# EAGLE design M7672X (EAGLE 6.6.0)
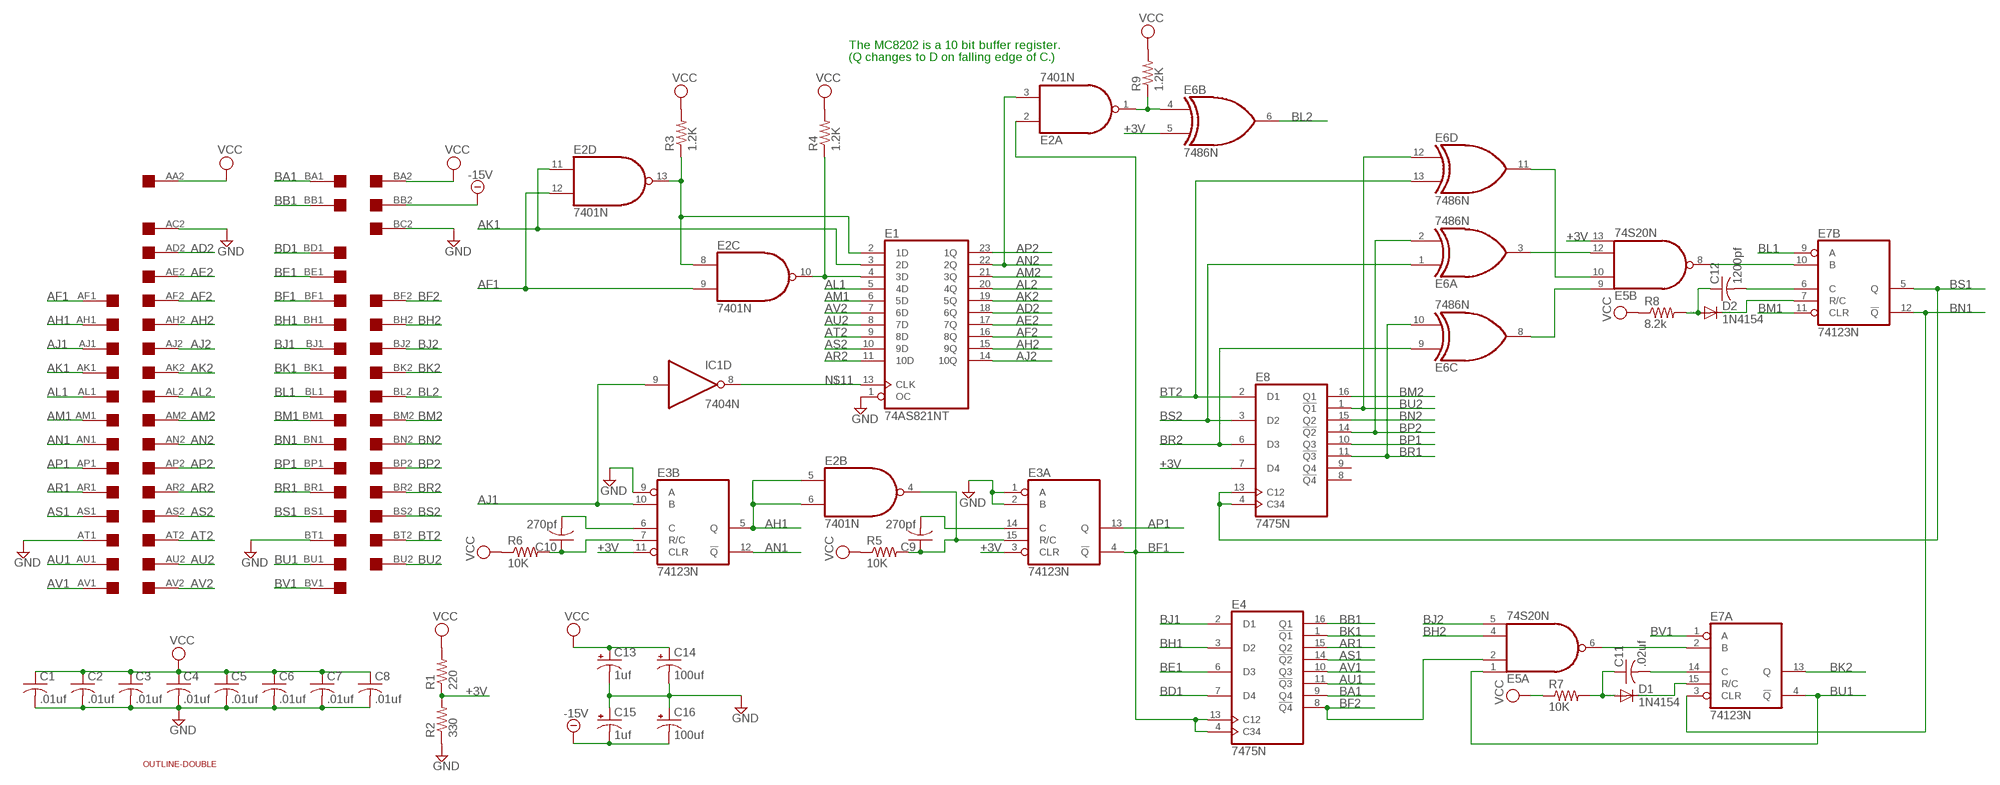
[diagram p0: schematic, sheet 1]

## Parts
C1  .01uf  C-US050-025X075  [C050-025X075]
C2  .01uf  C-US050-025X075  [C050-025X075]
C3  .01uf  C-US050-025X075  [C050-025X075]
C4  .01uf  C-US050-025X075  [C050-025X075]
C5  .01uf  C-US050-025X075  [C050-025X075]
C6  .01uf  C-US050-025X075  [C050-025X075]
C7  .01uf  C-US050-025X075  [C050-025X075]
C8  .01uf  C-US050-025X075  [C050-025X075]
C9  270pf  C-US050-025X075  [C050-025X075]
C10  270pf  C-US050-025X075  [C050-025X075]
C11  .02uf  C-US050-025X075  [C050-025X075]
C12  1200pf  C-US050-025X075  [C050-025X075]
C13  1uf  CPOL-USE30-10AXIAL  [E30-10]
C14  100uf  CPOL-USE30-10AXIAL  [E30-10]
C15  1uf  CPOL-USE30-10AXIAL  [E30-10]
C16  100uf  CPOL-USE30-10AXIAL  [E30-10]
D1  1N4154  1N4148DO35-10  [DO35-10]
D2  1N4154  1N4148DO35-10  [DO35-10]
E1  74AS821NT  [DIL24-6]
E2  7401N  74LS01N  [DIL14]
E3  74123N  [DIL16]
E4  7475N  [DIL16]
E5  74S20N  [DIL14]
E6  7486N  [DIL14]
E7  74123N  [DIL16]
E8  7475N  [DIL16]
EDGE  DOUBLE  [EDGE-CON4]
IC1  7404N  [DIL14]
R1  220  R-US_0207/10  [0207/10]
R2  330  R-US_0207/10  [0207/10]
R3  1.2K  R-US_0207/10  [0207/10]
R4  1.2K  R-US_0207/10  [0207/10]
R5  10K  R-US_0207/10  [0207/10]
R6  10K  R-US_0207/10  [0207/10]
R7  10K  R-US_0207/10  [0207/10]
R8  8.2k  R-US_0207/10  [0207/10]
R9  1.2K  R-US_0207/10  [0207/10]
U$2  OUTLINE-DOUBLE  [DOUBLE]

## Nets
+3V: E3.3(A:CLR) E3.11(B:CLR) E5.13(B:I3) E6.5(B:I1) E8.7(D4) R1.1 R2.2
-15V: C15.- C16.- EDGE.BB2
AD2: E1.18(6Q) EDGE.AD2
AE2: E1.17(7Q) EDGE.AE2
AF1: E2.9(C:I1) E2.12(D:I1) EDGE.AF1
AF2: E1.16(8Q) EDGE.AF2
AH1: E2.5(B:I0) E2.6(B:I1) E3.5(B:Q) EDGE.AH1
AH2: E1.15(9Q) EDGE.AH2
AJ1: E3.10(B:B) EDGE.AJ1 IC1.9(D:I)
AJ2: E1.14(10Q) EDGE.AJ2
AK1: E1.3(2D) E2.11(D:I0) EDGE.AK1
AK2: E1.19(5Q) EDGE.AK2
AL1: E1.5(4D) EDGE.AL1
AL2: E1.20(4Q) EDGE.AL2
AM1: E1.6(5D) EDGE.AM1
AM2: E1.21(3Q) EDGE.AM2
AN1: E3.12(B:!Q) EDGE.AN1
AN2: E1.22(2Q) E2.3(A:I1) EDGE.AN2
AP1: E3.13(A:Q) EDGE.AP1
AP2: E1.23(1Q) EDGE.AP2
AR1: E4.15(Q2) EDGE.AR1
AR2: E1.11(10D) EDGE.AR2
AS1: E4.14(!Q2) EDGE.AS1
AS2: E1.10(9D) EDGE.AS2
AT2: E1.9(8D) EDGE.AT2
AU1: E4.11(!Q3) EDGE.AU1
AU2: E1.8(7D) EDGE.AU2
AV1: E4.10(Q3) EDGE.AV1
AV2: E1.7(6D) EDGE.AV2
BA1: E4.9(Q4) EDGE.BA1
BB1: E4.16(Q1) EDGE.BB1
BD1: E4.7(D4) EDGE.BD1
BE1: E4.6(D3) EDGE.BE1
BF1: E2.2(A:I0) E3.4(A:!Q) E4.4(C34) E4.13(C12) EDGE.BF1
BF2: E4.8(!Q4) E5.2(A:I1) EDGE.BF2
BH1: E4.3(D2) EDGE.BH1
BH2: E5.4(A:I2) EDGE.BH2
BJ1: E4.2(D1) EDGE.BJ1
BJ2: E5.5(A:I3) EDGE.BJ2
BK1: E4.1(!Q1) EDGE.BK1
BK2: E7.13(A:Q) EDGE.BK2
BL1: E7.9(B:A) EDGE.BL1
BL2: E6.6(B:O) EDGE.BL2
BM1: E7.11(B:CLR) EDGE.BM1
BM2: E8.16(Q1) EDGE.BM2
BN1: E7.3(A:CLR) E7.12(B:!Q) EDGE.BN1
BN2: E8.15(Q2) EDGE.BN2
BP1: E8.10(Q3) EDGE.BP1
BP2: E6.2(A:I1) E8.14(!Q2) EDGE.BP2
BR1: E6.10(C:I1) E8.11(!Q3) EDGE.BR1
BR2: E6.9(C:I0) E8.6(D3) EDGE.BR2
BS1: E7.5(B:Q) E8.4(C34) E8.13(C12) EDGE.BS1
BS2: E6.1(A:I0) E8.3(D2) EDGE.BS2
BT2: E6.13(D:I1) E8.2(D1) EDGE.BT2
BU1: E5.1(A:I0) E7.4(A:!Q) EDGE.BU1
BU2: E6.12(D:I0) E8.1(!Q1) EDGE.BU2
BV1: E7.1(A:A) EDGE.BV1
GND [power]: C1.2 C2.2 C3.2 C4.2 C5.2 C6.2 C7.2 C8.2 C13.- C14.- C15.+ C16.+ E1.1(OC) E3.1(A:A) E3.2(A:B) E3.9(B:A) EDGE.AC2 EDGE.AT1 EDGE.BC2 EDGE.BT1 R2.1
N$1: E1.2(1D) E2.8(C:I0) E2.13(D:O) R3.1
N$2: E1.4(3D) E2.10(C:O) R4.1
N$3: E2.1(A:O) E6.4(B:I0) R9.1
N$4: E5.12(B:I2) E6.3(A:O)
N$5: C10.1 E3.7(B:R/C) R6.2
N$6: C10.2 E3.6(B:C)
N$7: C9.1 E2.4(B:O) E3.15(A:R/C) R5.2
N$8: C9.2 E3.14(A:C)
N$9: E5.10(B:I1) E6.11(D:O)
N$10: E5.9(B:I0) E6.8(C:O)
N$11: E1.13(CLK) IC1.8(D:O)
N$12: E5.6(A:O) E7.2(A:B)
N$13: D1.C E7.15(A:R/C)
N$14: C11.2 E7.14(A:C)
N$15: C11.1 D1.A R7.2
N$16: E5.8(B:O) E7.10(B:B)
N$17: D2.C E7.7(B:R/C)
N$18: C12.2 E7.6(B:C)
N$19: C12.1 D2.A R8.2
VCC [power]: C1.1 C2.1 C3.1 C4.1 C5.1 C6.1 C7.1 C8.1 C13.+ C14.+ EDGE.AA2 EDGE.BA2 R1.2 R3.2 R4.2 R5.1 R6.1 R7.1 R8.1 R9.2
Unconnected: E8.8(!Q4) E8.9(Q4) EDGE.AA1 EDGE.AB1 EDGE.AB2 EDGE.AC1 EDGE.AD1 EDGE.AE1 EDGE.BC1 EDGE.BD2 EDGE.BE2 EDGE.BV2 IC1.1(A:I) IC1.2(A:O) IC1.3(B:I) IC1.4(B:O) IC1.5(C:I) IC1.6(C:O) IC1.10(E:O) IC1.11(E:I) IC1.12(F:O) IC1.13(F:I)

## Notes on the sheet
- The MC8202 is a 10 bit buffer register.
- (Q changes to D on falling edge of C.)

## Power pins joined to a net without a drawn wire
GND: E1.12(GND) E2.7(P:GND) E3.8(P:GND) E4.12(GND) E5.7(P:GND) E6.7(P:GND) E7.8(P:GND) E8.12(GND) IC1.7(P:GND)
VCC: E1.24(VCC) E2.14(P:VCC) E3.16(P:VCC) E4.5(VCC) E5.14(P:VCC) E6.14(P:VCC) E7.16(P:VCC) E8.5(VCC) IC1.14(P:VCC)

## Library data of the parts
C1-C12 = rcl:C-US: CAPACITOR, American symbol
C13-C16 = rcl:CPOL-US: POLARIZED CAPACITOR, American symbol
D1 D2 = diode:1N4148: DIODE high speed (Philips)
E1 = 74xx-us:74*821: 10-bit bus interface FLIP FLOP
E2 = 74xx-us:74*01: Quad 2-input NAND gate, open collector
E3 E7 = 74xx-us:74*123: Retriggerable monostable MULTIVIBRATOR
E4 E8 = 74xx-us:74*75: 4-bit bistable LATCH
E5 = 74xx-us:74*20: Dual 4-input NAND gate
E6 = 74xx-us:74*86: Quad 2-input EXCLUSIV-OR (XOR) gate
EDGE = dec-con:DOUBLE: Double-Height DEC board
IC1 = 74xx-us:74*04: Hex INVERTER
R1-R9 = rcl:R-US_: RESISTOR, American symbol
U$2 = dec-con:OUTLINE-*: Board outlines for DEC boards.

## Net classes
1 power: width 0.508 mm

## Board
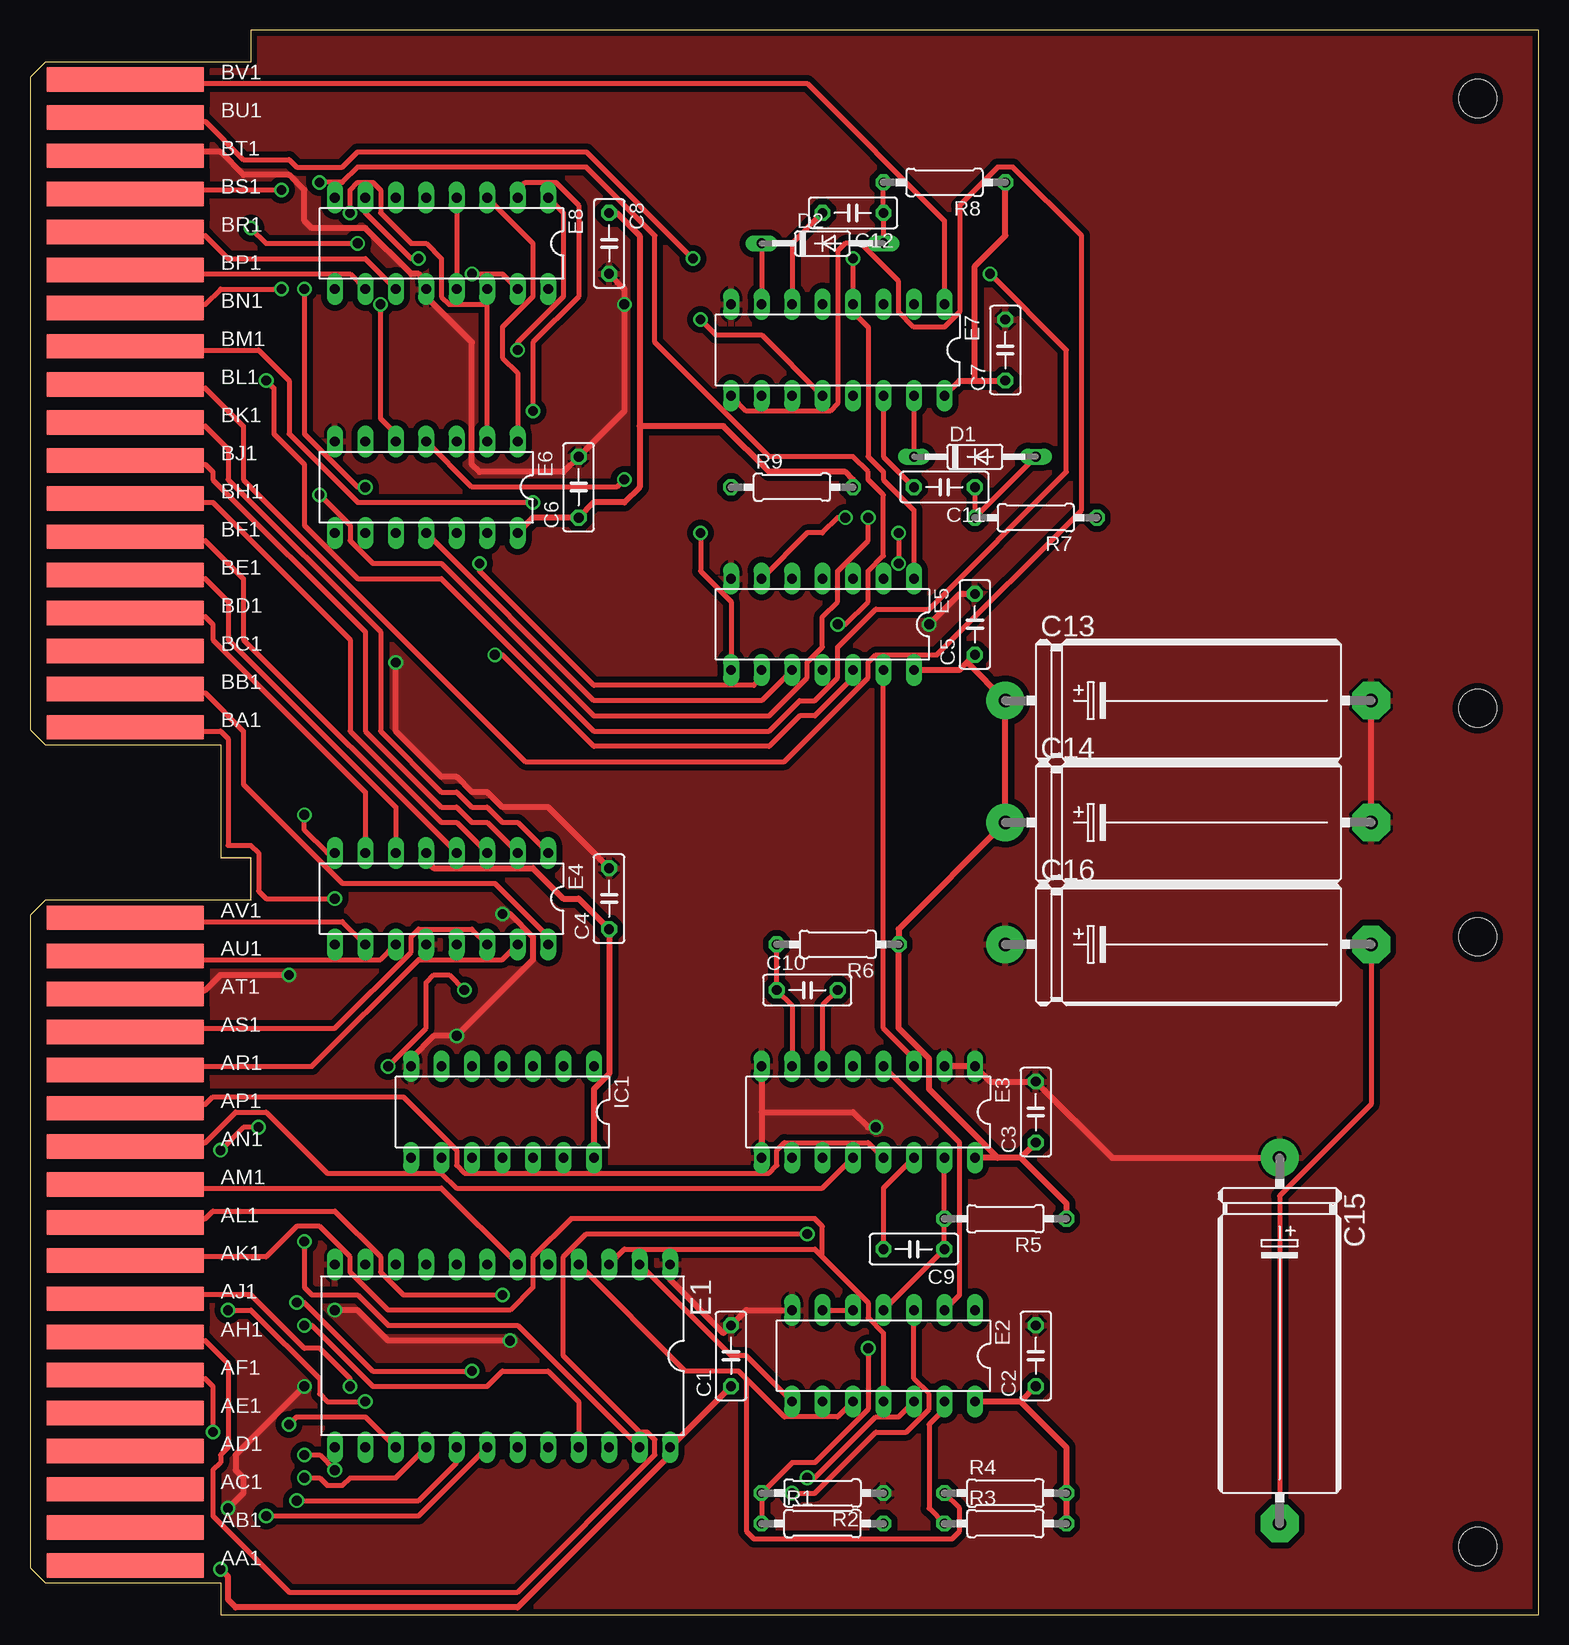
[diagram p1: board, top side]
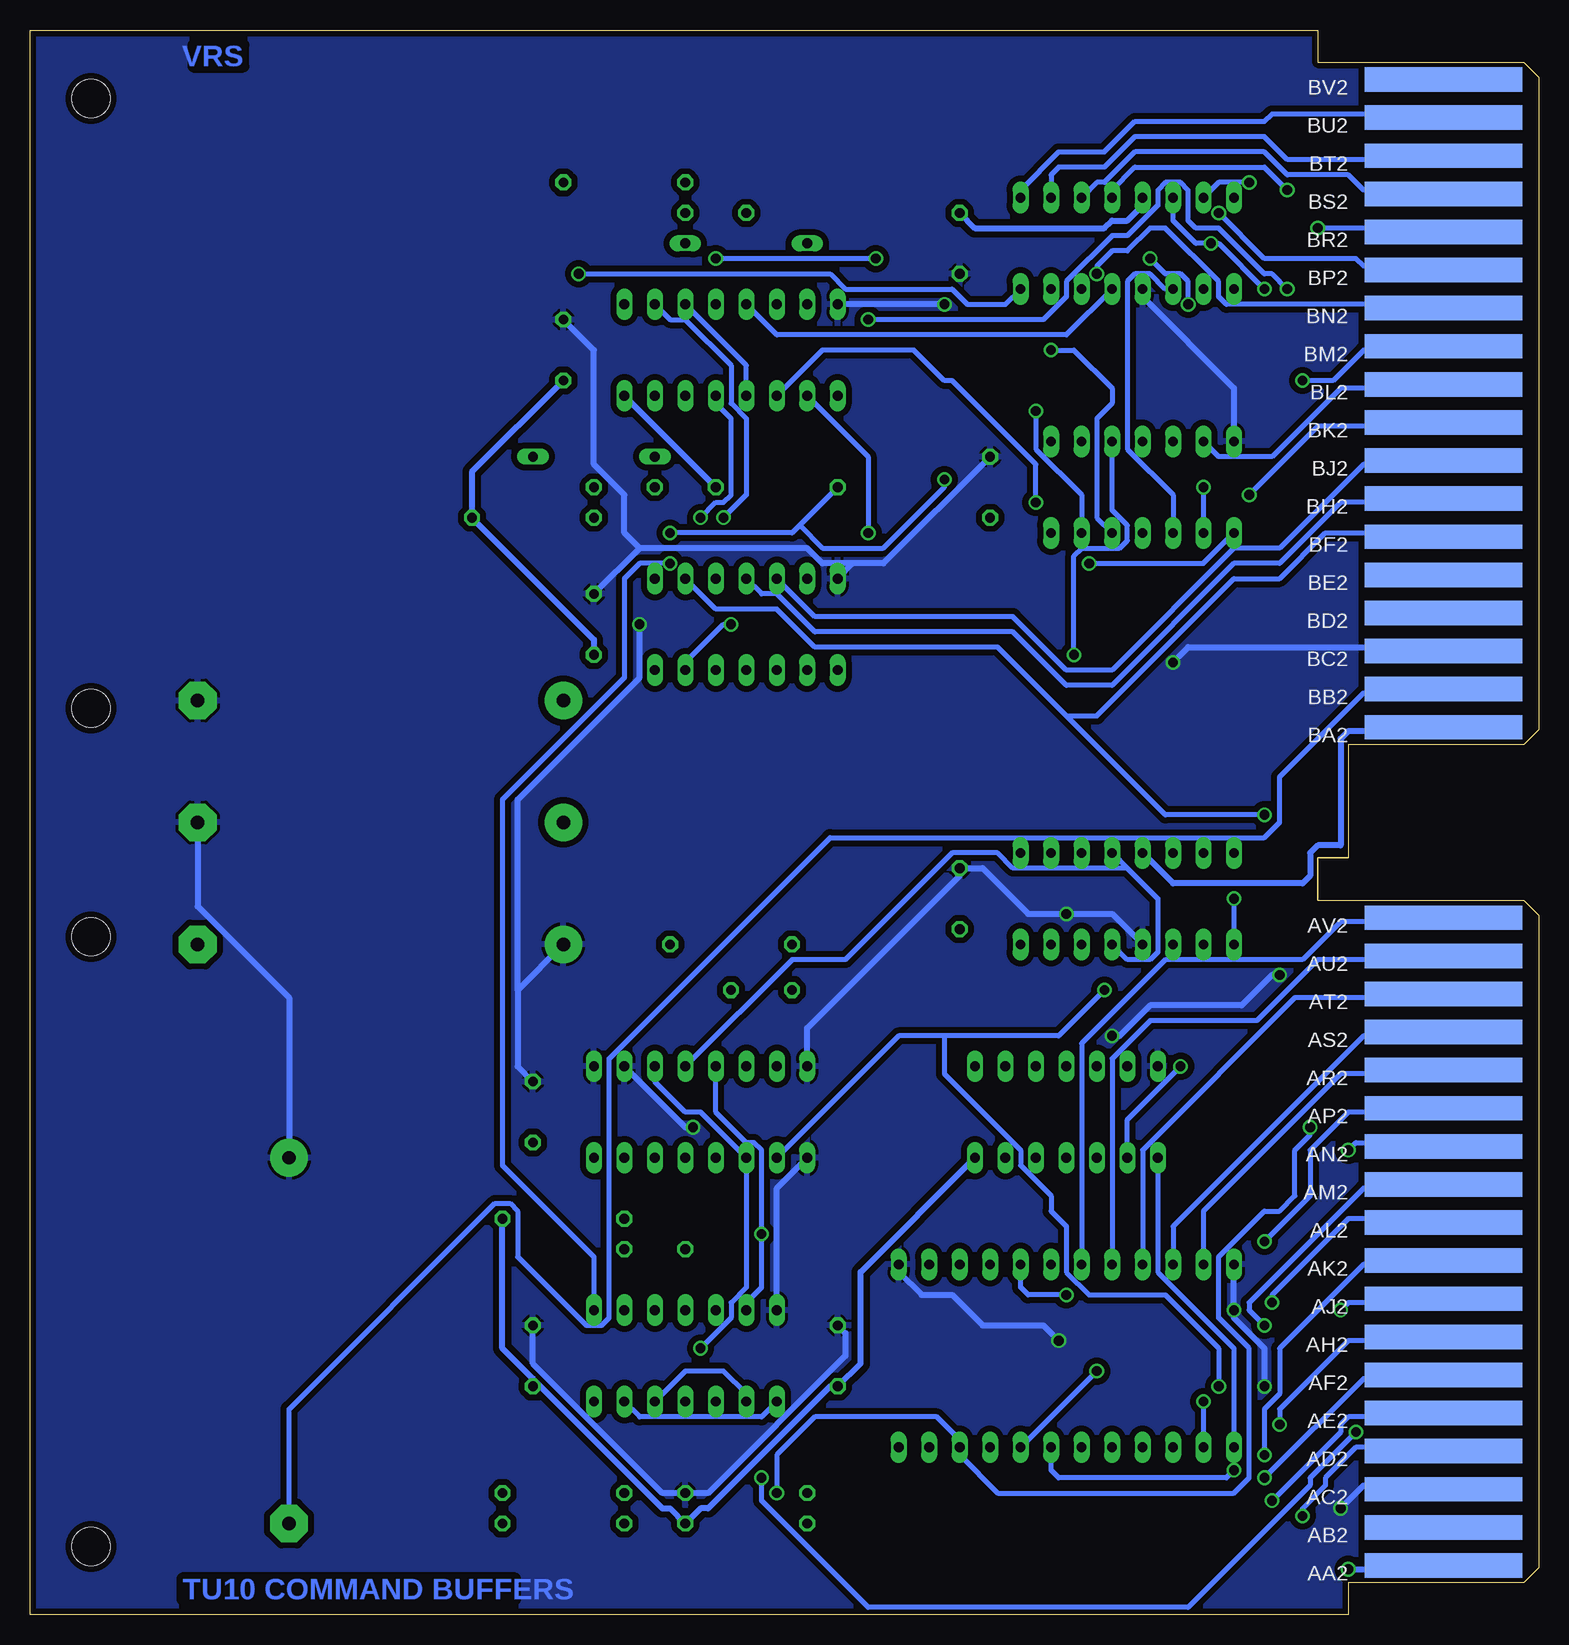
[diagram p2: board, bottom side, seen from below]

Size 125.73 x 132.08 mm. Coordinates in mm from the lower left corner, seen from the top.
Copper layers (1+16): Top 0.035mm / dielectric 1.5mm / Bottom 0.035mm
Design rules "16mils": minimum track width 16mil, minimum drill 32mil, track to track 15mil, track to pad 10mil, pad to pad 10mil, via to via 10mil, smd to smd 10mil, copper to edge 13mil, drill to drill 10mil, minimum pad ring 10mil, minimum via ring 8mil, stop-mask expansion 0mil, vias tented up to drill 0mil, thermal gap 10mil

### Footprints (pad centres in the part's own frame; a part is rotated, then mirrored left to right if it is on the bottom)
C050-025X075 = drill 0.813 octagon: 1 -2.54,0; 2 2.54,0
E30-10 = drill 1.118 pad 3.15: + -15.24,0 | drill 1.118 pad 3.15 octagon: - 15.24,0
DO35-10 = drill 0.813 long: A 5.08,0; C -5.08,0
DIL24-6 = drill 0.813 long: 1 -13.97,-7.62; 2 -11.43,-7.62; 3 -8.89,-7.62; 4 -6.35,-7.62; 5 -3.81,-7.62; 6 -1.27,-7.62; 7 1.27,-7.62; 8 3.81,-7.62; 9 6.35,-7.62; 10 8.89,-7.62; 11 11.43,-7.62; 12 13.97,-7.62; 13 13.97,7.62; 14 11.43,7.62; 15 8.89,7.62; 16 6.35,7.62; 17 3.81,7.62; 18 1.27,7.62; 19 -1.27,7.62; 20 -3.81,7.62; 21 -6.35,7.62; 22 -8.89,7.62; 23 -11.43,7.62; 24 -13.97,7.62
DIL14 = drill 0.813 long: 1 -7.62,-3.81; 2 -5.08,-3.81; 3 -2.54,-3.81; 4 0,-3.81; 5 2.54,-3.81; 6 5.08,-3.81; 7 7.62,-3.81; 8 7.62,3.81; 9 5.08,3.81; 10 2.54,3.81; 11 0,3.81; 12 -2.54,3.81; 13 -5.08,3.81; 14 -7.62,3.81
DIL16 = drill 0.813 long: 1 -8.89,-3.81; 2 -6.35,-3.81; 3 -3.81,-3.81; 4 -1.27,-3.81; 5 1.27,-3.81; 6 3.81,-3.81; 7 6.35,-3.81; 8 8.89,-3.81; 9 8.89,3.81; 10 6.35,3.81; 11 3.81,3.81; 12 1.27,3.81; 13 -1.27,3.81; 14 -3.81,3.81; 15 -6.35,3.81; 16 -8.89,3.81
EDGE-CON4 = smd 13.106 x 2.032: AA1 7.938,4.128; AB1 7.938,7.303; AC1 7.938,10.477; AD1 7.938,13.652; AE1 7.938,16.828; AF1 7.938,20.003; AH1 7.938,23.177; AJ1 7.938,26.352; AK1 7.938,29.527; AL1 7.938,32.703; AM1 7.938,35.877; AN1 7.938,39.053; AP1 7.938,42.227; AR1 7.938,45.403; AS1 7.938,48.578; AT1 7.938,51.752; AU1 7.938,54.928; AV1 7.938,58.102; BA1 7.938,73.978; BB1 7.938,77.153; BC1 7.938,80.328; BD1 7.938,83.502; BE1 7.938,86.677; BF1 7.938,89.853; BH1 7.938,93.028; BJ1 7.938,96.203; BK1 7.938,99.377; BL1 7.938,102.552; BM1 7.938,105.728; BN1 7.938,108.903; BP1 7.938,112.078; BR1 7.938,115.252; BS1 7.938,118.427; BT1 7.938,121.603; BU1 7.938,124.778; BV1 7.938,127.953 | smd 13.106 x 2.032 bottom: AA2 7.938,4.128; AB2 7.938,7.303; AC2 7.938,10.477; AD2 7.938,13.652; AE2 7.938,16.828; AF2 7.938,20.003; AH2 7.938,23.177; AJ2 7.938,26.352; AK2 7.938,29.527; AL2 7.938,32.703; AM2 7.938,35.877; AN2 7.938,39.053; AP2 7.938,42.227; AR2 7.938,45.403; AS2 7.938,48.578; AT2 7.938,51.752; AU2 7.938,54.928; AV2 7.938,58.102; BA2 7.938,73.978; BB2 7.938,77.153; BC2 7.938,80.328; BD2 7.938,83.502; BE2 7.938,86.677; BF2 7.938,89.853; BH2 7.938,93.028; BJ2 7.938,96.203; BK2 7.938,99.377; BL2 7.938,102.552; BM2 7.938,105.728; BN2 7.938,108.903; BP2 7.938,112.078; BR2 7.938,115.252; BS2 7.938,118.427; BT2 7.938,121.603; BU2 7.938,124.778; BV2 7.938,127.953
0207/10 = drill 0.813 octagon: 1 -5.08,0; 2 5.08,0
DOUBLE = hole 3.175: 120.65,56.515; 120.65,5.715; 120.65,75.565; 120.65,126.365

### Placement (x,y rotation side)
C1  58.42,21.59 90 top
C2  83.82,21.59 90 top
C3  83.82,41.91 90 top
C4  48.26,59.69 90 top
C5  78.74,82.55 90 top
C6  45.72,93.98 90 top
C7  81.28,105.41 90 top
C8  48.26,114.3 270 top
C9  73.66,30.48 180 top
C10  64.77,52.07 0 top
C11  76.2,93.98 180 top
C12  68.58,116.84 180 top
C13  96.52,76.2 0 top
C14  96.52,66.04 0 top
C15  104.14,22.86 270 top
C16  96.52,55.88 0 top
D1  78.74,96.52 0 top
D2  66.04,114.3 0 top
E1  39.37,21.59 180 top
E2  71.12,21.59 180 top
E3  69.85,41.91 180 top
E4  34.29,59.69 180 top
E5  66.04,82.55 180 top
E6  33.02,93.98 180 top
E7  67.31,105.41 180 top
E8  34.29,114.3 180 top
EDGE  0,0 0 top
IC1  39.37,41.91 180 top
R1  66.04,7.62 0 top
R2  66.04,10.16 180 top
R3  81.28,7.62 0 top
R4  81.28,10.16 0 top
R5  81.28,33.02 180 top
R6  67.31,55.88 180 top
R7  83.82,91.44 180 top
R8  76.2,119.38 180 top
R9  63.5,93.98 0 top
U$2  0,0 0 top

### Tracks (layer width: path | path; a pad name or v marks a point on that pad's centre or on a via)
+3V  (via drill 0.81)
  Top 0.406: E8.7 27.94,116.84 31.75,113.03 v32.39,113.03 | v29.21,109.22 29.21,99.69 30.48,98.42 E6.5 | R1.1 R2.2 63.5,12.7 65.41,12.7 69.85,17.14 v69.85,22.23 | E5.13 71.12,48.9 73.66,46.35 E3.3 | v24.13,119.38 26.04,119.38 27.31,120.65 46.36,120.65 52.07,114.94 52.07,106.05 61.6,96.52 68.58,96.52 69.85,95.25 69.85,94.61 71.12,93.34 71.12,88.27 69.85,87 69.85,84.45 67.95,82.55 v67.31,82.55
  Bottom 0.406: v32.39,113.03 31.12,111.76 29.85,111.76 29.21,111.12 v29.21,109.22 | E3.3 73.66,44.45 71.12,41.91 69.85,41.91 E3.11 66.04,27.3 67.31,26.04 67.31,24.77 v69.85,22.23 | E8.7 26.67,119.38 v24.13,119.38 | v67.31,82.55 67.95,82.55 71.12,79.38 E5.13
-15V
  Top 0.406: C15.- 104.14,34.92 111.76,42.55 C16.-
  Bottom 0.406: C15.- 104.14,17.14 87,34.29 85.73,34.29 85.09,33.66 85.09,29.84 79.38,24.13 78.11,24.13 77.47,24.77 77.47,46.35 59.06,64.77 22.86,64.77 21.59,66.04 21.59,69.85 14.61,76.83 8.26,76.83 EDGE.BB2
AD2  (via drill 0.81)
  Top 0.406: E1.18 32.39,8.26 v19.69,8.26
  Bottom 0.406: v19.69,8.26 19.69,8.89 17.78,10.79 17.78,11.43 15.24,13.97 8.26,13.97 EDGE.AD2
AE2  (via drill 0.81)
  Top 0.406: E1.17 35.56,12.7 32.39,9.53 v22.23,9.53
  Bottom 0.406: v22.23,9.53 16.51,15.24 16.51,15.88 15.88,16.51 12.07,16.51 11.43,17.14 8.26,17.14 EDGE.AE2
AF1  (via drill 0.81)
  Top 0.406: E2.12 72.39,16.51 70.49,16.51 65.41,11.43 v64.77,11.43 | v15.24,15.24 15.24,19.05 14.61,19.68 12.07,19.68 11.43,20.32 8.26,20.32 EDGE.AF1
  Bottom 0.406: E2.12 71.12,20.32 67.95,20.32 66.04,18.41 E2.9 | v64.77,11.43 64.77,9.53 55.88,0.64 29.21,0.64 19.05,10.79 19.05,11.43 v15.24,15.24
AF2  (via drill 0.81)
  Top 0.406: E1.16 30.48,11.43 26.67,11.43 26.04,10.79 24.77,10.79 24.13,11.43 v22.86,11.43
  Bottom 0.406: v22.86,11.43 14.61,19.68 12.07,19.68 11.43,20.32 8.26,20.32 EDGE.AF2
AH1  (via drill 0.81)
  Top 0.406: E2.6 E2.5 | v64.77,31.75 46.36,31.75 44.45,29.84 44.45,21.59 50.8,15.24 51.44,15.24 52.07,14.61 52.07,13.34 40.64,1.91 21.59,1.91 15.24,8.26 15.24,12.06 15.88,12.7 15.88,13.34 16.51,13.97 16.51,20.95 14.61,22.86 12.07,22.86 11.43,23.5 8.26,23.5 EDGE.AH1
  Bottom 0.406: E3.5 68.58,41.91 66.04,39.37 65.41,39.37 64.77,38.73 v64.77,31.75 64.77,27.3 66.04,26.04 E2.6
AH2  (via drill 0.81)
  Top 0.406: E1.15 27.94,16.51 22.23,16.51 v21.59,15.88
  Bottom 0.406: v21.59,15.88 21.59,17.14 15.88,22.86 12.07,22.86 11.43,23.5 8.26,23.5 EDGE.AH2
AJ1  (via drill 0.81)
  Top 0.406: v36.2,52.07 34.93,53.34 33.66,53.34 33.02,52.7 33.02,48.9 v29.85,45.72 | v26.67,19.05 26.67,19.68 24.13,22.23 22.86,22.23 18.42,26.67 8.26,26.67 EDGE.AJ1
  Bottom 0.406: E3.10 53.34,48.26 49.53,48.26 | 49.53,48.26 40.01,48.26 v36.2,52.07 | v29.85,45.72 34.29,41.27 IC1.9 | v26.67,19.05 26.67,22.23 31.12,26.67 37.47,26.67 39.37,28.57 39.37,32.38 40.64,33.66 40.64,34.92 43.18,37.47 43.18,38.73 49.53,45.09 49.53,48.26
AJ2  (via drill 0.81)
  Top 0.406: v27.94,17.78 24.77,17.78 24.13,18.41 24.13,19.68 18.42,25.4 v16.51,25.4
  Bottom 0.406: v27.94,17.78 E1.14 | v16.51,25.4 15.88,26.04 12.07,26.04 11.43,26.67 8.26,26.67 EDGE.AJ2
AK1
  Top 0.406: E2.11 71.12,23.5 69.85,24.77 69.85,26.04 66.04,29.84 | 66.04,29.84 65.41,30.48 49.53,30.48 E1.3 | 66.04,29.84 66.04,32.38 65.41,33.02 45.09,33.02 41.91,29.84 41.91,27.3 40.01,25.4 29.85,25.4 26.67,28.57 26.67,29.84 24.13,32.38 22.23,32.38 19.69,29.84 8.26,29.84 EDGE.AK1
AK2  (via drill 0.81)
  Top 0.406: v25.4,12.06 24.13,13.34 v22.86,13.34
  Bottom 0.406: E1.19 40.64,12.06 40.01,11.43 26.04,11.43 v25.4,12.06 | v22.86,13.34 22.86,17.14 21.59,18.41 21.59,22.23 14.61,29.21 12.07,29.21 11.43,29.84 8.26,29.84 EDGE.AK2
AL1  (via drill 0.81)
  Top 0.406: v39.37,26.67 31.12,26.67 29.21,28.57 29.21,29.84 25.4,33.66 15.24,33.66 14.61,33.02 8.26,33.02 EDGE.AL1
  Bottom 0.406: E1.5 43.18,27.3 42.55,26.67 v39.37,26.67
AL2  (via drill 0.81)
  Top 0.406: v36.83,20.32 28.58,20.32 22.86,26.04 v22.23,26.04
  Bottom 0.406: v36.83,20.32 E1.20 | v22.23,26.04 22.23,26.67 15.88,33.02 8.26,33.02 EDGE.AL2
AM1
  Top 0.406: E1.6 34.29,35.56 8.26,35.56 EDGE.AM1
AM2  (via drill 0.81)
  Top 0.406: E1.21 45.72,17.78 43.18,20.32 39.37,20.32 38.1,19.05 28.58,19.05 23.5,24.13 v22.86,24.13
  Bottom 0.406: v22.86,24.13 24.13,25.4 24.13,26.04 14.61,35.56 12.07,35.56 11.43,36.2 8.26,36.2 EDGE.AM2
AN1
  Top 0.406: E3.12 66.04,35.56 35.56,35.56 34.29,36.83 24.77,36.83 19.69,41.91 17.15,41.91 14.61,39.37 8.26,39.37 EDGE.AN1
AN2  (via drill 0.81)
  Top 0.406: E2.3 73.66,19.68 74.93,18.41 74.93,17.14 73.03,15.24 70.49,15.24 65.41,10.16 v63.5,10.16 | v15.88,38.73 17.78,40.64 v19.05,40.64
  Bottom 0.406: v63.5,10.16 63.5,13.34 60.33,16.51 50.17,16.51 48.26,14.61 E1.22 48.26,13.34 45.09,10.16 25.4,10.16 24.13,11.43 24.13,22.23 26.67,24.77 26.67,29.84 22.86,33.66 21.59,33.66 20.32,34.92 20.32,38.73 19.05,40.01 v19.05,40.64 | v15.88,38.73 15.24,39.37 8.26,39.37 EDGE.AN2
AP1
  Top 0.406: E3.13 69.85,39.37 62.87,39.37 62.23,38.73 62.23,37.47 61.6,36.83 36.2,36.83 35.56,37.47 35.56,38.73 31.12,43.18 15.24,43.18 14.61,42.55 8.26,42.55 EDGE.AP1
AP2  (via drill 0.81)
  Top 0.406: E1.23 40.64,24.13 29.85,24.13 27.31,26.67 23.5,26.67 22.86,27.3 v22.86,31.11
  Bottom 0.406: v22.86,31.11 19.05,34.92 19.05,38.73 15.88,41.91 12.07,41.91 11.43,42.55 8.26,42.55 EDGE.AP2
AR1
  Top 0.406: E4.15 39.37,54.61 32.39,54.61 23.5,45.72 8.26,45.72 EDGE.AR1
AR2
  Bottom 0.406: E1.11 27.94,33.66 16.51,45.09 8.26,45.09 EDGE.AR2
AS1
  Top 0.406: E4.14 36.83,57.15 32.39,57.15 31.75,56.52 31.75,55.24 25.4,48.9 8.26,48.9 EDGE.AS1
AS2
  Bottom 0.406: E1.10 30.48,32.38 14.61,48.26 8.26,48.26 EDGE.AS2
AT2
  Bottom 0.406: E1.9 33.02,38.73 20.32,51.44 8.26,51.44 EDGE.AT2
AU1
  Top 0.406: E4.11 29.21,54.61 8.26,54.61 EDGE.AU1
AU2
  Bottom 0.406: E1.8 35.56,46.35 32.39,49.53 23.5,49.53 18.42,54.61 8.26,54.61 EDGE.AU2
AV1
  Top 0.406: E4.10 26.04,57.78 8.26,57.78 EDGE.AV1
AV2
  Bottom 0.406: E1.7 38.1,47.62 31.12,54.61 19.69,54.61 16.51,57.78 8.26,57.78 EDGE.AV2
BA1  (via drill 0.81)
  Top 0.406: v25.4,59.69 19.69,59.69 19.05,60.33 19.05,63.5 18.42,64.14 16.51,64.14 16.51,73.03 15.88,73.66 10.16,73.66 9.53,74.3 8.26,74.3 EDGE.BA1
  Bottom 0.406: v25.4,59.69 E4.9
BB1
  Top 0.406: E4.16 43.18,56.52 38.74,60.96 26.04,60.96 17.78,69.22 17.78,73.66 14.61,76.83 8.26,76.83 EDGE.BB1
BD1
  Top 0.406: E4.7 27.94,68.58 15.24,81.28 15.24,82.55 14.61,83.19 8.26,83.19 EDGE.BD1
BE1
  Top 0.406: E4.6 30.48,67.31 16.51,81.28 16.51,84.45 14.61,86.36 8.26,86.36 EDGE.BE1
BF1
  Top 0.406: E3.4 77.47,39.37 77.47,26.67 E2.2 | E4.4 17.78,81.28 17.78,86.36 14.61,89.53 8.26,89.53 EDGE.BF1
  Bottom 0.406: E4.13 34.29,54.61 32.39,54.61 31.75,55.24 31.75,59.69 34.29,62.23 | E4.4 34.29,62.23 | E3.4 62.23,54.61 57.79,54.61 48.9,63.5 45.09,63.5 43.82,62.23 34.29,62.23
BF2  (via drill 0.81)
  Top 0.406: v22.86,66.67 22.86,65.41 24.77,63.5 E4.8
  Bottom 0.406: E5.2 68.58,83.82 63.5,83.82 60.33,80.64 45.09,80.64 39.37,74.93 | 39.37,74.93 31.12,66.67 v22.86,66.67 | 39.37,74.93 36.83,74.93 25.4,86.36 21.59,86.36 17.78,90.17 8.26,90.17 EDGE.BF2
BH1
  Top 0.406: E4.3 35.56,66.04 34.29,66.04 26.67,73.66 26.67,81.28 15.24,92.71 8.26,92.71 EDGE.BH1
BH2
  Bottom 0.406: E5.4 64.77,85.09 63.5,85.09 60.33,81.92 43.82,81.92 39.37,77.47 35.56,77.47 25.4,87.63 21.59,87.63 16.51,92.71 8.26,92.71 EDGE.BH2
BJ1
  Top 0.406: E4.2 38.1,66.04 36.83,66.04 35.56,67.31 34.29,67.31 27.94,73.66 27.94,81.92 15.24,94.61 15.24,95.25 14.61,95.89 8.26,95.89 EDGE.BJ1
BJ2
  Bottom 0.406: E5.5 60.33,83.19 43.82,83.19 39.37,78.74 35.56,78.74 25.4,88.9 21.59,88.9 14.61,95.89 8.26,95.89 EDGE.BJ2
BK1
  Top 0.406: E4.1 40.64,66.04 39.37,66.04 38.1,67.31 36.83,67.31 35.56,68.58 34.29,68.58 29.21,73.66 29.21,81.92 16.51,94.61 16.51,97.16 14.61,99.06 8.26,99.06 EDGE.BK1
BK2  (via drill 0.81)
  Top 0.406: v69.85,91.44 69.85,89.53 67.31,87 67.31,84.45 66.04,83.19 66.04,80.64 64.77,79.38 64.77,78.11 61.6,74.93 46.99,74.93 34.29,87.63 28.58,87.63 26.67,89.53 26.67,90.81 v24.13,93.34
  Bottom 0.406: E7.13 68.58,100.97 67.31,99.69 67.31,93.34 67.95,92.71 68.58,92.71 v69.85,91.44 | v24.13,93.34 18.42,99.06 12.07,99.06 11.43,99.69 8.26,99.69 EDGE.BK2
BL1
  Top 0.406: E7.9 59.69,100.33 66.68,100.33 67.31,100.97 67.31,113.67 67.95,114.3 69.22,114.3 72.39,111.12 72.39,108.58 73.66,107.31 76.2,107.31 77.47,108.58 77.47,117.47 80.65,120.65 81.92,120.65 87.63,114.94 87.63,92.08 75.57,80.01 70.49,80.01 69.85,79.38 69.85,78.11 62.87,71.12 41.28,71.12 17.78,94.61 17.78,99.06 14.61,102.23 8.26,102.23 EDGE.BL1
BL2
  Bottom 0.406: E6.6 26.67,96.52 22.23,96.52 16.51,102.23 8.26,102.23 EDGE.BL2
BM1  (via drill 0.81)
  Top 0.406: v41.91,92.71 27.31,92.71 21.59,98.42 21.59,102.87 19.05,105.41 12.07,105.41 11.43,106.05 8.26,106.05 EDGE.BM1
  Bottom 0.406: E7.11 59.69,105.41 52.07,105.41 49.53,102.87 48.9,102.87 41.91,95.89 v41.91,92.71
BM2  (via drill 0.81)
  Top 0.406: v80.01,111.76 86.36,105.41 86.36,95.25 74.93,83.82 70.49,83.82 67.31,80.64 67.31,78.11 65.41,76.2 64.14,76.2 61.6,73.66 46.99,73.66 34.29,86.36 27.31,86.36 22.86,90.81 22.86,95.89 20.32,98.42 20.32,102.23 v19.69,102.87
  Bottom 0.406: E8.16 44.45,109.22 47.63,109.22 48.9,110.49 57.79,110.49 59.06,111.76 v80.01,111.76 | v19.69,102.87 17.15,102.87 14.61,105.41 12.07,105.41 11.43,106.05 8.26,106.05 EDGE.BM2
BN1  (via drill 0.81)
  Top 0.406: E7.12 60.96,106.68 57.15,106.68 v55.88,107.95 | v20.96,110.49 15.88,110.49 14.61,109.22 8.26,109.22 EDGE.BN1
  Bottom 0.406: E7.3 66.04,104.14 E7.12 | v55.88,107.95 41.28,107.95 39.37,109.86 39.37,111.12 35.56,114.94 34.29,114.94 31.75,117.47 31.75,118.75 31.12,119.38 29.85,119.38 29.21,118.75 29.21,116.2 28.58,115.57 26.67,115.57 22.86,111.76 22.23,111.76 v20.96,110.49
BN2  (via drill 0.81)
  Top 0.406: E8.15 39.37,111.76 v36.83,111.76
  Bottom 0.406: v36.83,111.76 36.83,112.39 35.56,113.67 34.29,113.67 32.39,115.57 31.12,115.57 26.67,111.12 26.67,109.86 26.04,109.22 8.26,109.22 EDGE.BN2
BP1
  Top 0.406: E8.10 26.67,111.76 8.26,111.76 EDGE.BP1
BP2  (via drill 0.81)
  Top 0.406: E6.2 38.1,109.22 | 38.1,109.22 E8.14 | 38.1,109.22 34.93,109.22 34.29,109.86 34.29,113.03 33.02,114.3 31.75,114.3 29.21,116.84 29.21,118.75 28.58,119.38 27.31,119.38 26.67,118.75 v26.67,116.84
  Bottom 0.406: v26.67,116.84 22.86,113.03 15.24,113.03 14.61,112.39 8.26,112.39 EDGE.BP2
BR1
  Top 0.406: E8.11 27.94,113.03 16.51,113.03 14.61,114.94 8.26,114.94 EDGE.BR1
  Bottom 0.406: E6.10 30.48,93.34 34.29,97.16 34.29,111.12 33.66,111.76 32.39,111.76 31.12,110.49 E8.11
BR2  (via drill 0.81)
  Top 0.406: v27.31,114.3 19.69,114.3 v18.42,115.57 | v27.94,93.98 27.31,93.98 22.86,98.42 v22.86,110.49
  Bottom 0.406: E8.6 30.48,116.2 28.58,114.3 v27.31,114.3 26.67,114.3 v22.86,110.49 | v18.42,115.57 8.26,115.57 EDGE.BR2 | v27.94,93.98 E6.9
BS1  (via drill 0.81)
  Top 0.406: E8.4 E8.13 | v20.96,118.75 8.26,118.75 EDGE.BS1
  Bottom 0.406: E7.5 63.5,106.68 39.37,106.68 E8.13 | v20.96,118.75 22.86,120.65 33.66,120.65 35.56,118.75 E8.4
BS2
  Top 0.406: E6.1 40.64,103.5 39.37,104.78 39.37,107.31 41.91,109.86 41.91,114.3 E8.3
  Bottom 0.406: E8.3 36.83,119.38 36.2,119.38 33.66,121.92 22.86,121.92 20.96,120.02 15.88,120.02 14.61,118.75 8.26,118.75 EDGE.BS2
BT2  (via drill 0.81)
  Top 0.406: v41.91,100.33 41.91,106.05 45.72,109.86 45.72,117.47 43.82,119.38 41.28,119.38 40.64,118.75 E8.2
  Bottom 0.406: E8.2 40.64,120.02 40.01,120.65 36.2,120.65 33.66,123.19 22.86,123.19 20.96,121.28 12.07,121.28 11.43,121.92 8.26,121.92 EDGE.BT2 | E6.13 38.1,93.34 41.91,97.16 v41.91,100.33
BU1  (via drill 0.81)
  Top 0.406: E5.1 73.66,92.08 71.12,94.61 71.12,95.25 69.85,96.52 69.85,107.31 68.58,108.58 E7.4 v68.58,113.03 | v55.25,113.03 46.36,121.92 27.31,121.92 26.04,120.65 22.23,120.65 21.59,121.28 17.78,121.28 14.61,124.46 12.07,124.46 11.43,125.09 8.26,125.09 EDGE.BU1
  Bottom 0.406: v55.25,113.03 v68.58,113.03
BU2  (via drill 0.81)
  Top 0.406: v40.64,105.41 40.64,106.05 44.45,109.86 44.45,116.84 E8.1
  Bottom 0.406: E6.12 36.83,91.44 36.83,99.69 35.56,100.97 35.56,102.23 38.74,105.41 v40.64,105.41 | E8.1 43.18,118.75 40.01,121.92 36.2,121.92 33.66,124.46 22.86,124.46 22.23,125.09 8.26,125.09 EDGE.BU2
BV1
  Top 0.406: E7.1 76.2,116.2 64.77,127.64 8.26,127.64 EDGE.BV1
GND  (via drill 0.81)
  Top 0.508: C8.2 49.53,110.49 v49.53,109.22 49.53,100.33 C6.2 44.45,95.25 37.47,95.25 36.83,95.89 36.83,106.05 33.02,109.86 E8.12 33.02,111.12 32.39,111.76 31.75,111.76 27.94,115.57 23.5,115.57 22.86,116.2 22.86,118.75 21.59,120.02 17.78,120.02 15.88,121.92 8.26,121.92 EDGE.BT1 | v25.4,25.4 27.31,25.4 29.85,22.86 v40.01,22.86 | v16.51,8.89 17.78,10.16 17.78,11.43 17.15,12.06 17.15,13.34 v22.86,19.05 | C14.- C13.- | IC1.7 31.75,46.35 33.66,48.26 v35.56,48.26 41.91,54.61 41.91,56.52 40.01,58.42 v39.37,58.42 | v21.59,53.34 15.88,53.34 14.61,52.07 8.26,52.07 EDGE.AT1 | E3.2 E3.1 80.01,44.45 C3.2 90.17,38.1 C15.+ | E3.8 60.96,41.91 | 60.96,41.91 E3.9 | E2.7 59.69,25.4 C1.2 57.79,23.5 53.34,27.94 E1.1 | v70.49,40.64 69.85,40.64 68.58,41.91 60.96,41.91 | v30.48,79.38 30.48,73.66 34.29,69.85 35.56,69.85 36.83,68.58 38.1,68.58 39.37,67.31 43.18,67.31 C4.2 | C5.2 77.47,85.09 v74.93,82.55
  Bottom 0.508: E6.7 25.4,102.23 33.02,109.86 E8.12 | 57.15,87.63 E5.7 | 57.15,87.63 54.61,87.63 C6.2 | 74.93,88.9 C5.2 | 74.93,88.9 60.96,88.9 59.69,87.63 57.15,87.63 | v49.53,109.22 E7.8 | C7.2 78.74,105.41 78.74,95.89 76.2,93.34 76.2,90.17 74.93,88.9 | E1.12 v25.4,25.4 25.4,24.77 22.86,22.23 v22.86,19.05 | v40.01,22.86 41.28,24.13 46.36,24.13 48.9,26.67 51.44,26.67 53.34,28.57 E1.1 | v16.51,8.89 14.61,10.79 8.26,10.79 EDGE.AC2 | C15.+ 104.14,51.44 111.76,59.05 C14.- | v35.56,48.26 34.93,48.26 32.39,50.8 24.77,50.8 22.23,53.34 v21.59,53.34 | C3.2 85.09,45.72 85.09,52.07 | C16.+ 85.09,52.07 | E4.12 35.56,58.42 v39.37,58.42 42.55,58.42 46.36,62.23 C4.2 48.26,61.59 60.96,48.9 E3.8 | C1.2 57.79,23.5 57.79,21.59 69.22,10.16 R2.1 73.03,10.16 83.82,20.95 C2.2 | E3.9 63.5,35.56 E2.7 | E3.2 71.12,40.64 v70.49,40.64 | v30.48,79.38 29.21,80.64 8.26,80.64 EDGE.BC2 | v74.93,82.55 74.93,78.11 85.09,67.94 85.09,52.07
  pour Bottom (isolate 0.508): 125.73,0 15.24,0 15.24,132.08 125.73,132.08
  pour Top (isolate 0.508): 125.73,0 15.24,0 15.24,132.08 125.73,132.08
N$1
  Top 0.406: R3.1 74.93,8.89 74.93,15.88 76.2,17.14 E2.13 | E1.2 58.42,21.59 59.69,21.59 E2.8
  Bottom 0.406: E2.13 74.93,16.51 64.77,16.51 E2.8
N$2
  Top 0.406: E1.4 54.61,20.32 59.06,20.32 59.69,19.68 | 59.69,19.68 62.87,16.51 67.31,16.51 E2.10 | R4.1 77.47,8.89 77.47,6.99 76.84,6.35 60.33,6.35 59.69,6.99 59.69,19.68
N$3  (via drill 0.81)
  Top 0.406: v72.39,90.17 v72.39,87.63 | E6.4 36.83,93.98 48.9,93.98 v49.53,94.61
  Bottom 0.406: E2.1 78.74,29.84 86.36,37.47 86.36,67.94 76.2,78.11 76.2,86.36 74.93,87.63 v72.39,87.63 | v72.39,90.17 62.23,90.17 61.6,90.81 | R9.1 61.6,90.81 | v49.53,94.61 49.53,93.98 54.61,88.9 59.69,88.9 61.6,90.81
N$4  (via drill 0.81)
  Top 0.406: v38.74,80.01 39.37,80.01 46.99,72.39 61.6,72.39 64.14,74.93 65.41,74.93 68.58,78.11 E5.12
  Bottom 0.406: E6.3 35.56,92.08 34.29,90.81 34.29,89.53 34.93,88.9 38.1,88.9 38.74,88.27 v38.74,80.01
N$5
  Top 0.406: E3.7 63.5,50.8 C10.1 R6.2
N$6
  Top 0.406: E3.6 66.04,50.8 C10.2
N$7
  Top 0.406: E2.4 C9.1 R5.2 E3.15
N$8
  Top 0.406: C9.2 71.12,35.56 E3.14
N$9
  Top 0.406: E6.11 46.99,76.2 60.96,76.2 E5.10
N$10  (via drill 0.81)
  Top 0.406: v37.47,87.63 37.47,87 46.99,77.47 60.33,77.47 60.96,78.11 E5.9
  Bottom 0.406: E6.8 27.94,87.63 v37.47,87.63
N$11
  Bottom 0.406: E1.13 25.4,22.23 31.75,28.57 IC1.8
N$12  (via drill 0.81)
  Top 0.406: E5.6 64.77,90.17 66.04,90.17 67.31,91.44 v67.95,91.44
  Bottom 0.406: v67.95,91.44 66.04,93.34 66.04,99.69 67.31,100.97 67.31,104.14 71.12,107.95 72.39,107.95 E7.2
N$13
  Top 0.406: E7.15 D1.C
N$14
  Top 0.406: C11.2 71.12,96.52 E7.14
N$15
  Top 0.406: C11.1 R7.2 D1.A
N$16  (via drill 0.81)
  Top 0.406: E5.8 58.42,84.45 55.88,87 v55.88,90.17
  Bottom 0.406: v55.88,90.17 55.88,96.52 E7.10
N$17
  Top 0.406: D2.C E7.7
N$18
  Top 0.406: E7.6 63.5,114.3 C12.2
N$19
  Top 0.406: D2.A C12.1 R8.2
VCC  (via drill 0.81)
  Top 0.508: E6.14 41.91,91.44 C6.1 46.99,92.71 49.53,92.71 50.8,93.98 50.8,99.06 | 50.8,99.06 50.8,114.94 48.9,116.84 C8.1 | E5.14 77.47,78.74 78.11,79.38 | C5.1 78.11,79.38 | 78.11,79.38 C13.+ C14.+ 72.39,57.15 R6.1 72.39,48.9 74.93,46.35 74.93,43.81 80.65,38.1 | 78.74,102.87 77.47,102.87 E7.16 | 78.74,102.87 C7.1 | R8.1 81.28,114.94 78.74,112.39 78.74,102.87 | 50.8,99.06 57.79,99.06 61.6,95.25 67.95,95.25 68.58,94.61 R9.2 | IC1.14 46.99,43.81 48.26,45.09 C4.1 45.72,59.69 44.45,59.69 41.91,62.23 33.66,62.23 33.02,62.87 E4.5 | C1.1 E1.24 53.34,13.34 40.64,0.64 17.15,0.64 16.51,1.27 16.51,3.17 v15.88,3.81 | 82.55,38.1 80.65,38.1 | 80.65,38.1 E3.16 | C3.1 82.55,38.1 | R5.1 86.36,34.29 82.55,38.1 | R3.2 R4.2 86.36,13.97 82.55,17.78 | 82.55,17.78 E2.14 | C2.1 82.55,17.78
  Bottom 0.508: E8.5 33.02,117.47 34.29,116.2 35.56,116.2 36.2,115.57 46.99,115.57 C8.1 | E7.16 R9.2 | C7.1 88.9,95.25 R7.1 78.74,81.28 C5.1 | E4.5 30.48,60.96 19.69,60.96 19.05,61.59 19.05,63.5 18.42,64.14 16.51,64.14 16.51,73.03 15.88,73.66 10.16,73.66 9.53,74.3 8.26,74.3 EDGE.BA2 | R5.1 86.36,22.23 83.82,19.68 | 83.82,19.68 73.03,8.89 72.39,8.89 R1.2 69.85,8.89 69.22,8.89 59.06,19.05 C1.1 56.52,20.95 56.52,28.57 IC1.14 | 83.82,19.68 C2.1 | v15.88,3.81 12.07,3.81 11.43,4.45 8.26,4.45 EDGE.AA2

### Text on the board
Bottom: VRS | TU10 COMMAND BUFFERS